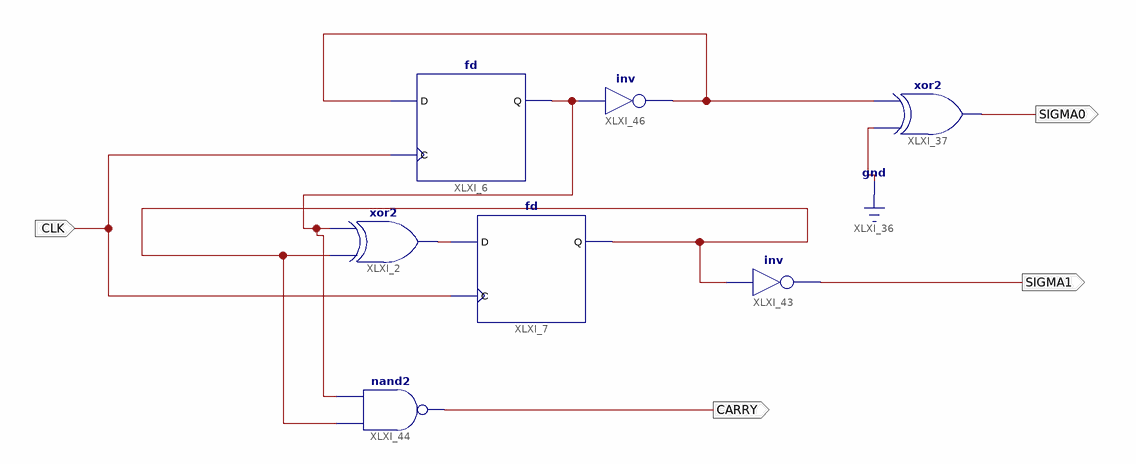
[diagram p0: schematic sheet 1]
// Xilinx ISE schematic CNT2.sch (virtex6) as structural Verilog: 7 symbols, 4 ports
module CNT2 (
  input  CLK,
  output CARRY,
  output SIGMA0,
  output SIGMA1
);

  wire SIG, XLXN_18, XLXN_106, XLXN_110;

  xor XLXI_2 (XLXN_18, SIG, XLXN_110);
  fd XLXI_6 (.C(CLK), .D(XLXN_106), .Q(XLXN_110));
  fd XLXI_7 (.C(CLK), .D(XLXN_18), .Q(SIG));
  xor XLXI_37 (SIGMA0, 1'b0, XLXN_106);
  not XLXI_43 (SIGMA1, SIG);
  nand XLXI_44 (CARRY, SIG, XLXN_110);
  not XLXI_46 (XLXN_106, XLXN_110);
endmodule
